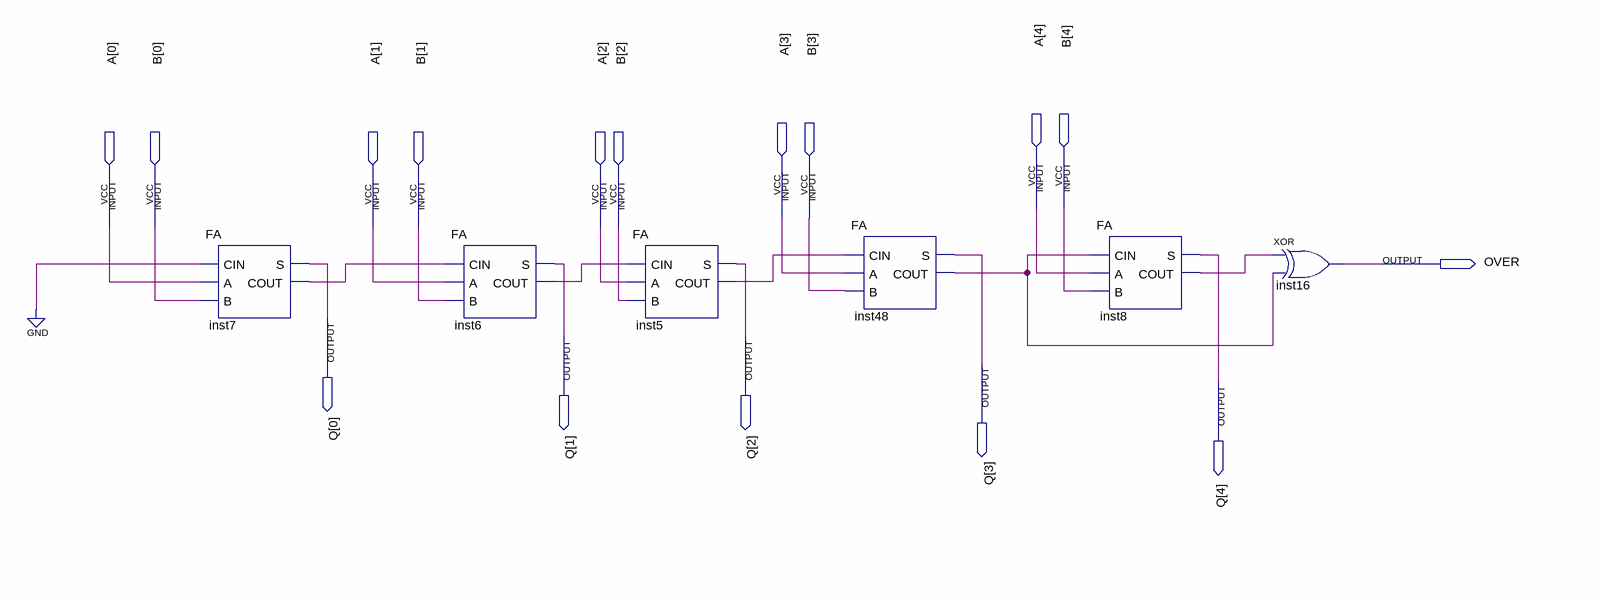
[diagram p0: schematic sheet]
// Quartus schematic FA_4BIT.bdf as structural Verilog: 6 symbols, 16 pins
module FA_4BIT (
  input  [4:0] A,
  input  [4:0] B,
  output OVER,
  output [4:0] Q
);

  wire inst5_cout, inst6_cout, inst7_cout, inst8_cout, inst48_cout;

  FA inst7 (.CIN(1'b0), .A(A[0]), .B(B[0]), .S(Q[0]), .COUT(inst7_cout));
  FA inst6 (.CIN(inst7_cout), .A(A[1]), .B(B[1]), .S(Q[1]), .COUT(inst6_cout));
  FA inst5 (.CIN(inst6_cout), .A(A[2]), .B(B[2]), .S(Q[2]), .COUT(inst5_cout));
  FA inst48 (.CIN(inst5_cout), .A(A[3]), .B(B[3]), .S(Q[3]), .COUT(inst48_cout));
  FA inst8 (.CIN(inst48_cout), .A(A[4]), .B(B[4]), .S(Q[4]), .COUT(inst8_cout));
  xor inst16 (OVER, inst8_cout, inst48_cout);
endmodule
